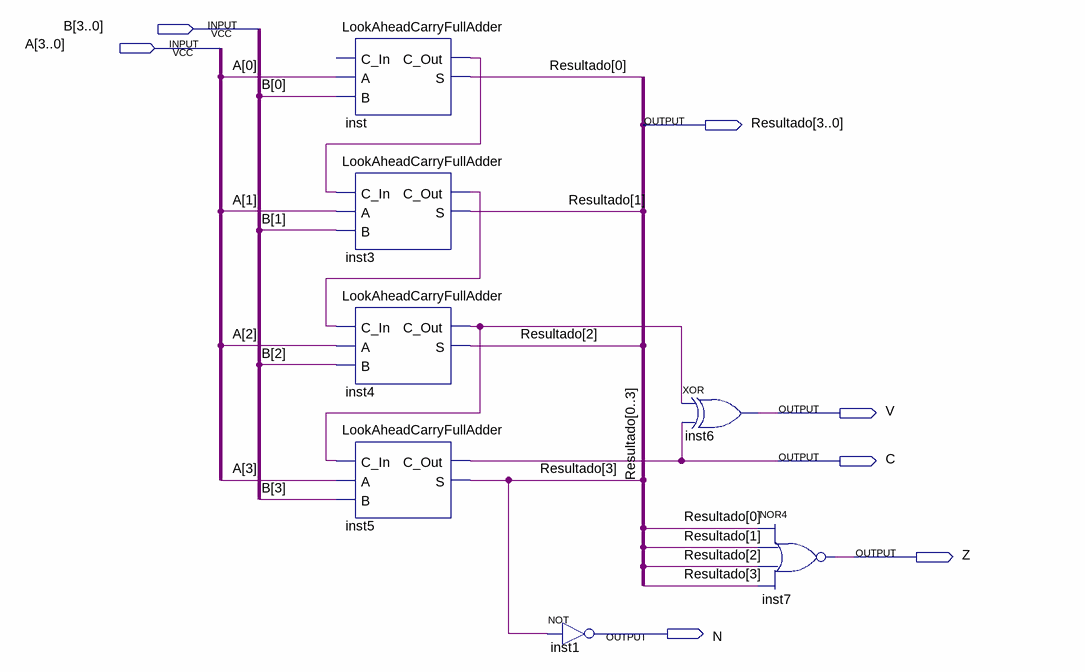
[diagram p0: schematic sheet]
// Quartus schematic AsumB.bdf as structural Verilog: 7 symbols, 7 pins
module AsumB (
  input  [3:0] B,
  input  [3:0] A,
  output [3:0] Resultado,
  output V,
  output C,
  output Z,
  output N
);

  wire inst3_c_out, inst4_c_out, inst_c_out;

  LookAheadCarryFullAdder inst (.A(A[0]), .B(B[0]), .C_Out(inst_c_out), .S(Resultado[0]));  // open: C_In
  LookAheadCarryFullAdder inst3 (.C_In(inst_c_out), .A(A[1]), .B(B[1]), .C_Out(inst3_c_out), .S(Resultado[1]));
  LookAheadCarryFullAdder inst4 (.C_In(inst3_c_out), .A(A[2]), .B(B[2]), .C_Out(inst4_c_out), .S(Resultado[2]));
  LookAheadCarryFullAdder inst5 (.C_In(inst4_c_out), .A(A[3]), .B(B[3]), .C_Out(C), .S(Resultado[3]));
  not inst1 (N, Resultado[3]);
  xor inst6 (V, inst4_c_out, C);
  nor inst7 (Z, Resultado[0], Resultado[1], Resultado[2], Resultado[3]);
endmodule
